# EAGLE design Tiny Programmer_dummy (EAGLE 6.1)
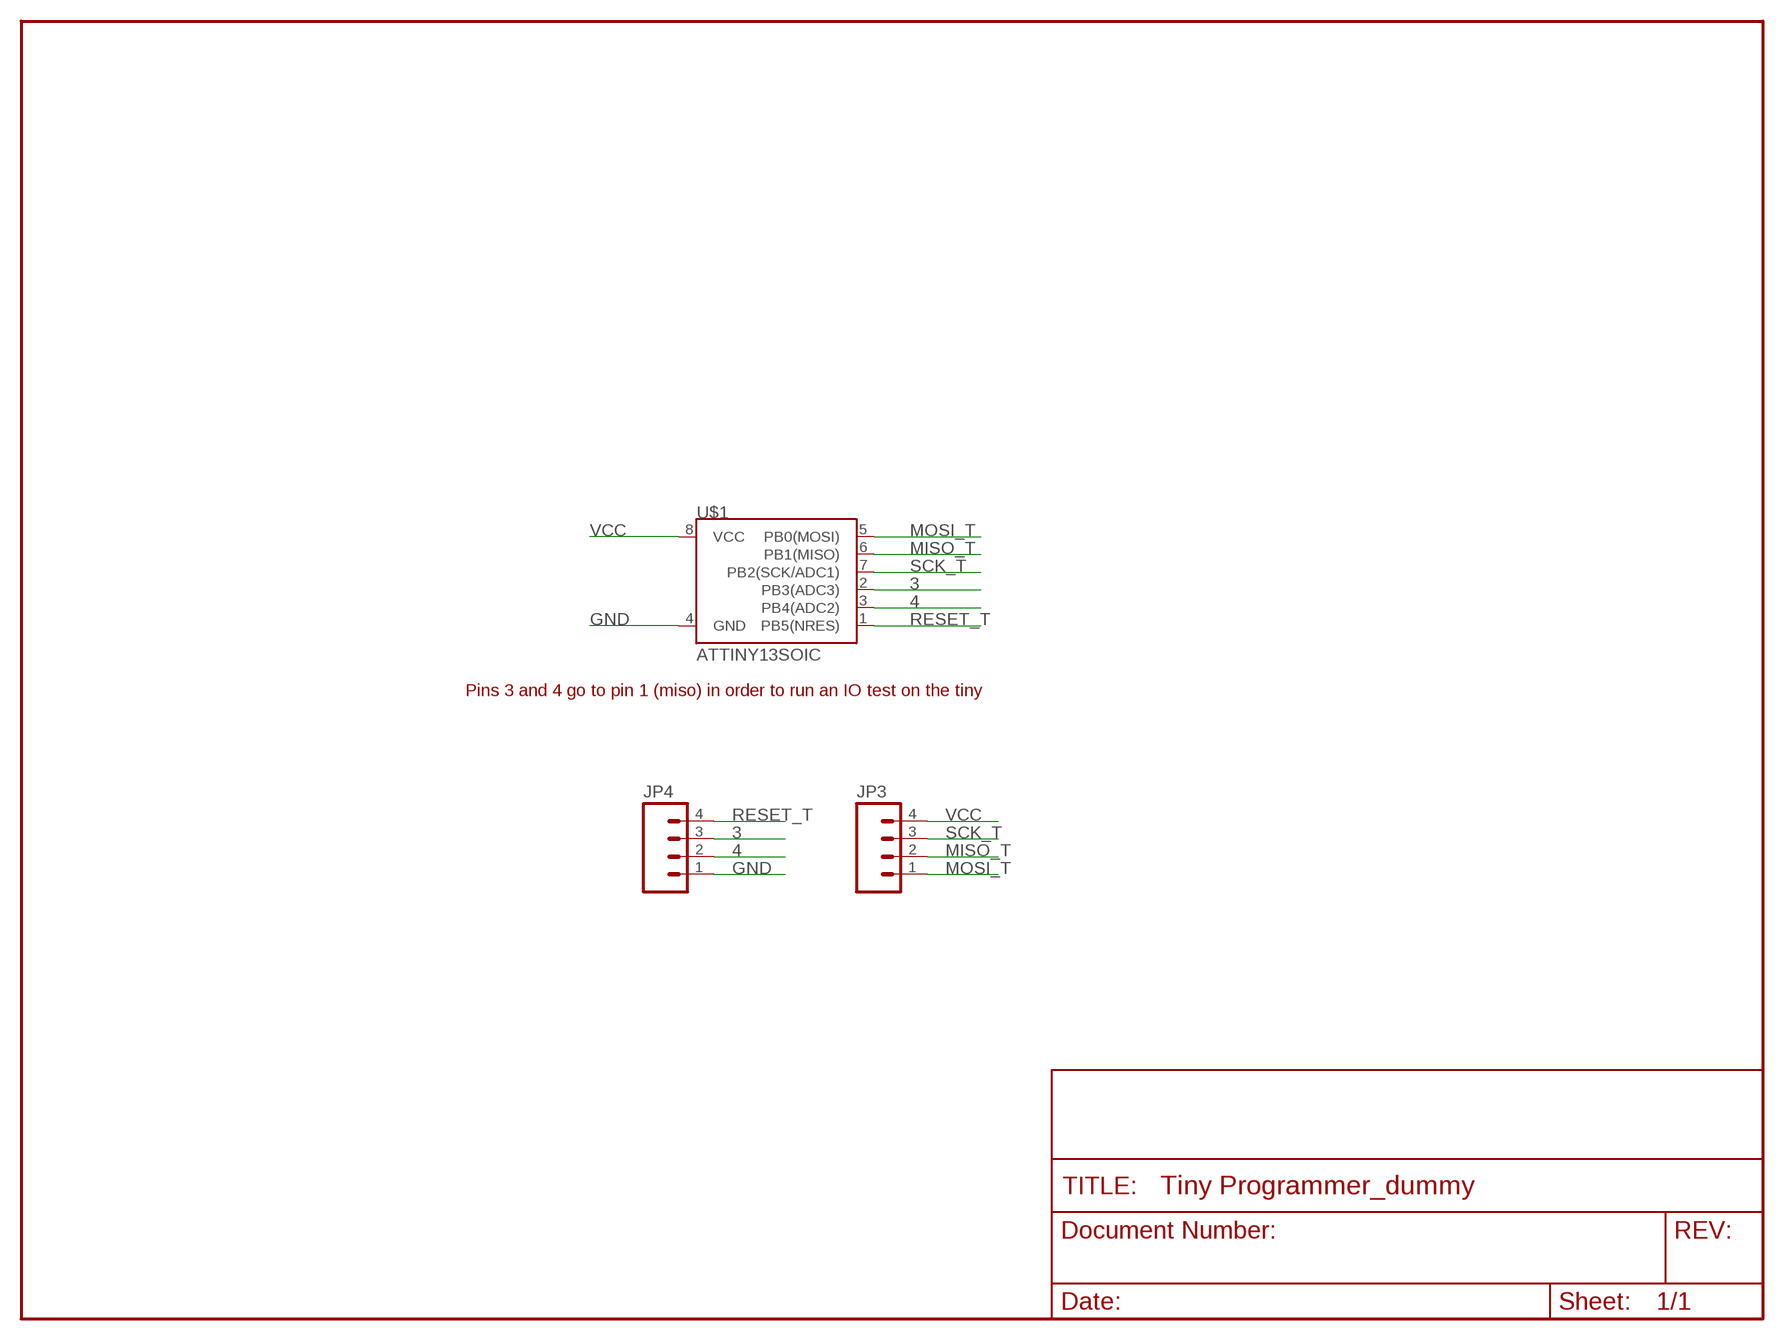
[diagram p0: schematic, sheet 1]

## Parts
JP3  M04PTH  [1X04]
JP4  M04PTH  [1X04]
U$1  ATTINY13SOIC  [SO08]

## Nets
3: JP4.3 U$1.2(PB3(ADC3))
4: JP4.2 U$1.3(PB4(ADC2))
GND: JP4.1 U$1.4(GND)
MISO_T: JP3.2 U$1.6(PB1(MISO))
MOSI_T: JP3.1 U$1.5(PB0(MOSI))
RESET_T: JP4.4 U$1.1(PB5(NRES))
SCK_T: JP3.3 U$1.7(PB2(SCK/ADC1))
VCC: JP3.4 U$1.8(VCC)

## Notes on the sheet
- Pins 3 and 4 go to pin 1 (miso) in order to run an IO test on the tiny

## Library data of the parts
JP3 JP4 = SparkFun:M04: Header 4 Standard 4-pin 0.1" header. Use with straight break away headers (SKU : PRT-00116), right angle break away headers (PRT-00553), swiss pins (PRT-00743), machine pins (PRT-00117), and female headers (PRT-00115). Molex polarized connector foot print use with SKU : PRT-08231 with associated crimp pins and housings. 1MM SMD Version SKU: PRT-10208
U$1 = SparkFun:ATTINY13

## Net classes
1 BIG: width 0.762 mm, clearance 0.305 mm to class 0, clearance 0.305 mm

## Board
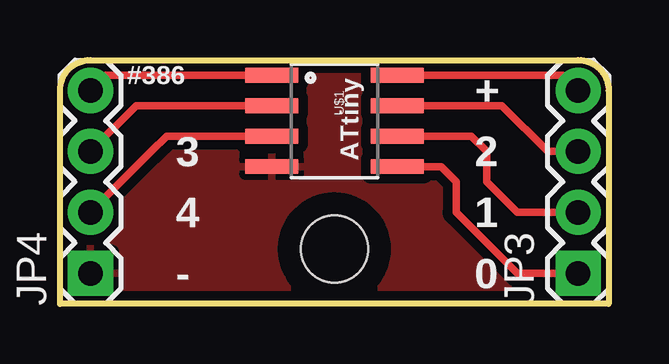
[diagram p1: board, top side]
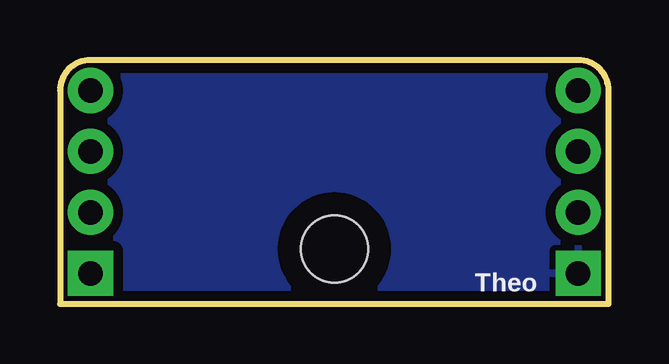
[diagram p2: board, bottom side, seen from below]

Size 22.86 x 10.16 mm. Coordinates in mm from the lower left corner, seen from the top.
Outline: 0,0 0,8.89 arc-90 1.27,10.16 21.59,10.16 arc-90 22.86,8.89 22.86,0 0,0
Copper layers (1*16): Top 0.035mm / dielectric 1.5mm / Bottom 0.035mm
Design rules: minimum track width 8mil, minimum drill 20mil, track to track 8mil, track to pad 8mil, pad to pad 8mil, via to via 8mil, smd to smd 8mil, copper to edge 8mil, drill to drill 8mil, minimum pad ring 12mil, minimum via ring 10mil, stop-mask expansion 4mil, vias tented up to drill 20mil, thermal gap 10mil

### Footprints (pad centres in the part's own frame; a part is rotated, then mirrored left to right if it is on the bottom)
1X04 = drill 1.016 pad 1.88 square: 1 0,0 | drill 1.016 pad 1.88: 2 2.54,0; 3 5.08,0; 4 7.62,0
SO08 = smd 0.61 x 2.21: 1 -1.905,-2.616; 2 -0.635,-2.616; 3 0.635,-2.616; 4 1.905,-2.616; 5 1.905,2.616; 6 0.635,2.616; 7 -0.635,2.616; 8 -1.905,2.616
STAND-OFF-TIGHTER = hole 2.794: 0,0

### Placement (x,y rotation side)
JP3  21.59,1.27 90 top
JP4  1.27,1.27 90 top
U$1  11.43,7.62 270 top
U$2  [STAND-OFF-TIGHTER]  11.43,2.29 0 top

### Tracks (layer width: path | path; a pad name or v marks a point on that pad's centre or on a via)
3
  Top 0.305: JP4.3 3.17,8.26 U$1.2
4
  Top 0.305: JP4.2 3.81,6.35 4.45,6.99 U$1.3
GND
  pour Bottom (isolate 0.406): 0,0 22.86,0 22.86,10.16 0,10.16
  pour Top (isolate 0.406): 0,10.16 0,0 22.86,0 22.86,10.16
MISO_T
  Top 0.305: U$1.6 17.14,6.99 17.78,6.35 17.78,5.08 19.05,3.81 JP3.2
MOSI_T
  Top 0.305: U$1.5 15.88,5.71 16.51,5.08 16.51,3.81 19.05,1.27 JP3.1
RESET_T
  Top 0.305: U$1.1 1.91,9.53 JP4.4
SCK_T
  Top 0.305: U$1.7 18.41,8.26 20.32,6.35 JP3.3
VCC
  Top 0.305: U$1.8 20.95,9.53 JP3.4

### Text on the board
tPlace: #386 | + | 3 | ATtiny | 2 | 4 | 1 | - | 0
bPlace: Theo